# EAGLE design seismometer_energyboard (EAGLE 7.0.0)
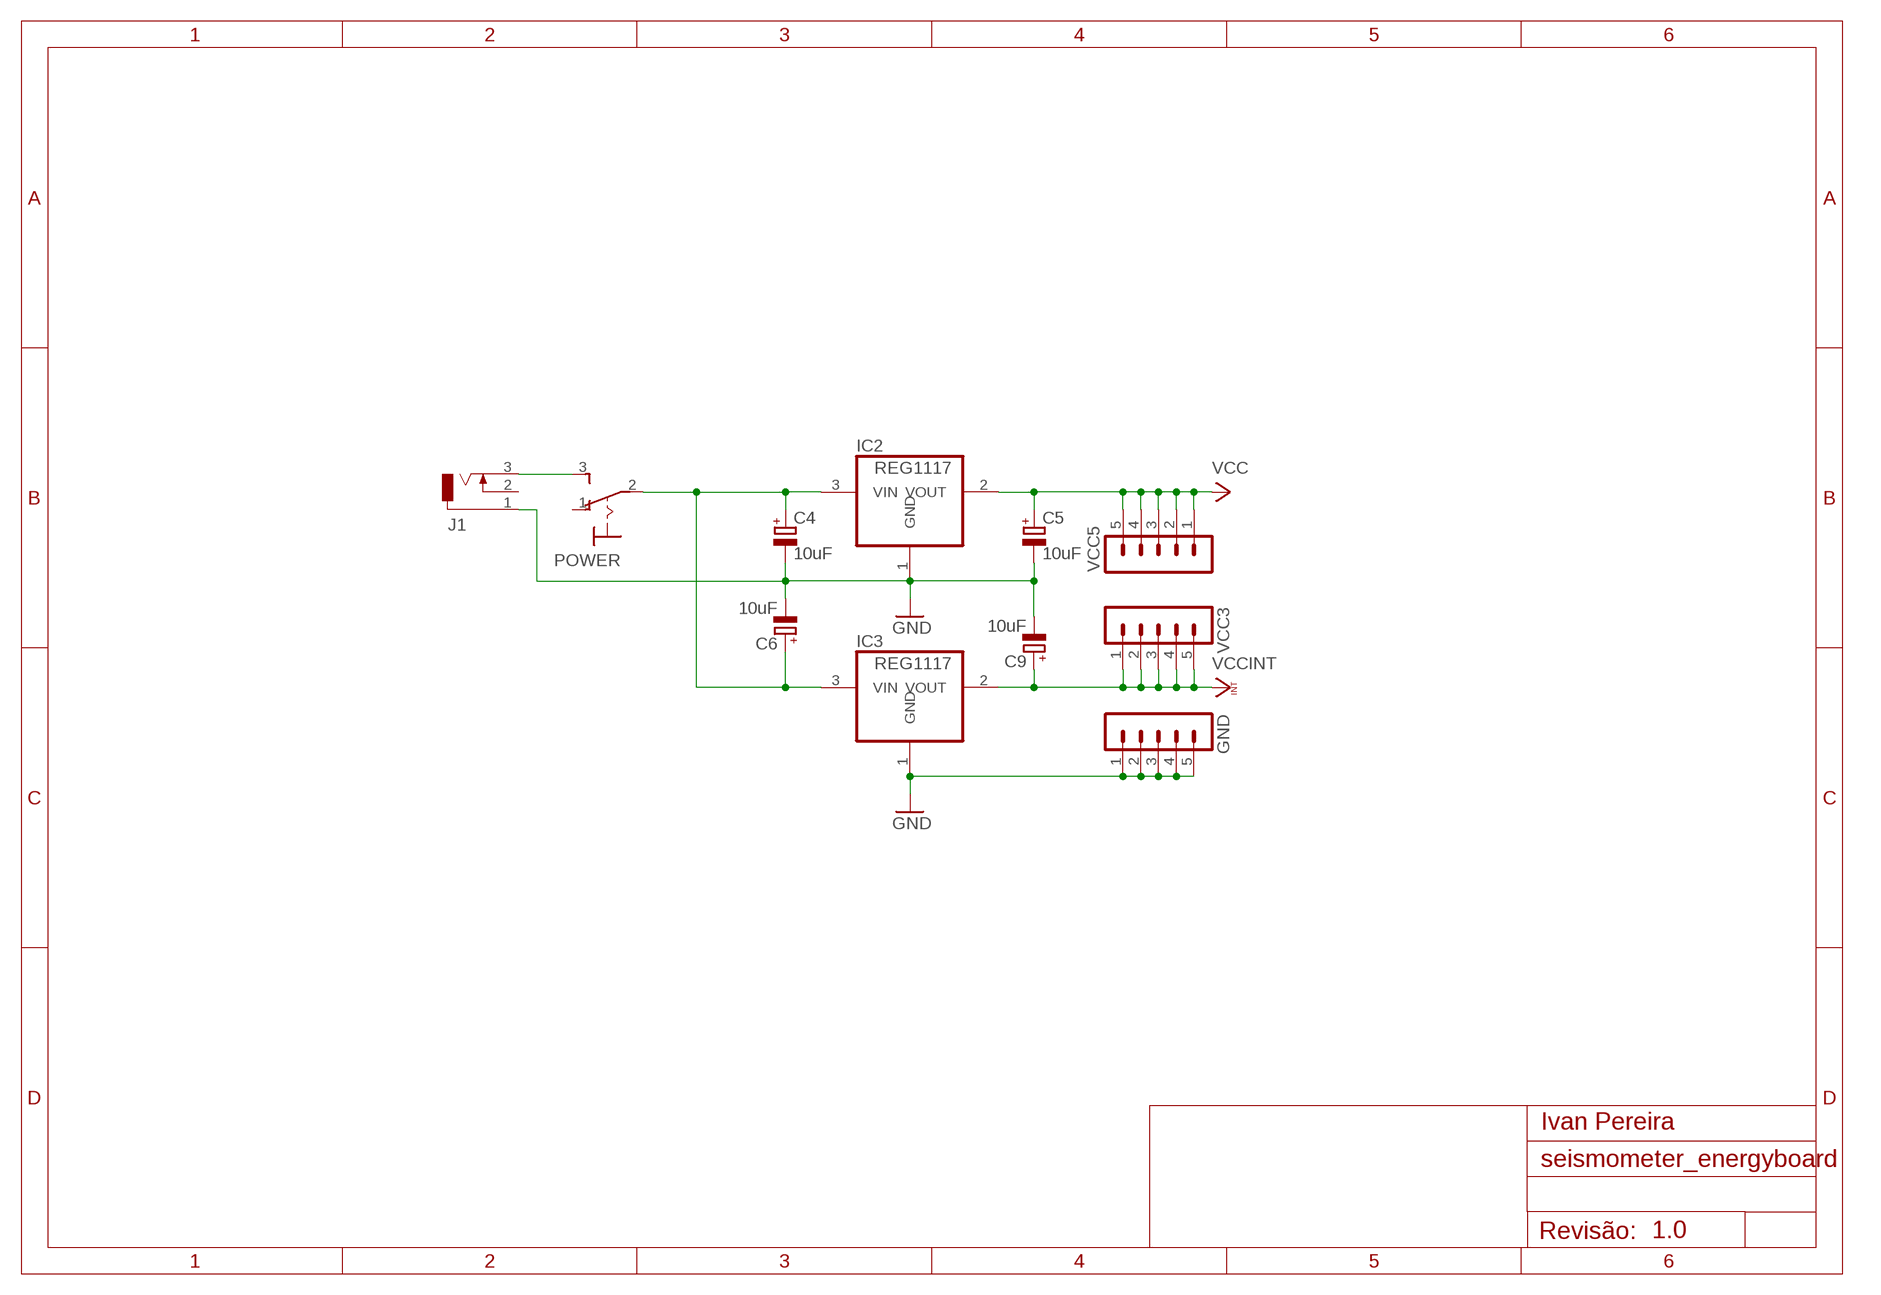
[diagram p0: schematic, sheet 1]
FRAME1 (A4L-LOC): AUTHOR: Ivan Pereira; REV: 1.0

## Parts
C4  10uF  CPOL-EUE2.5-6  [E2,5-6]
C5  10uF  CPOL-EUE2.5-6  [E2,5-6]
C6  10uF  CPOL-EUE2.5-6  [E2,5-6]
C9  10uF  CPOL-EUE2.5-6  [E2,5-6]
GND  MA05-1  [MA05-1]
IC2  REG1117  [SOT223]
IC3  REG1117  [SOT223]
J1  DCJ0303  [DCJ0303]
POWER  320-916  [320-916]
VCC3  MA05-1  [MA05-1]
VCC5  MA05-1  [MA05-1]

## Nets
GND: C4.- C5.- C6.- C9.- GND.1 GND.2 GND.3 GND.4 GND.5 IC2.1(GND) IC3.1(GND) J1.1
N$27: C4.+ C6.+ IC2.3(VIN) IC3.3(VIN) POWER.2(P)
N$29: J1.3 POWER.3(S)
VCC: C5.+ IC2.2(VOUT) VCC5.1 VCC5.2 VCC5.3 VCC5.4 VCC5.5
VCCINT: C9.+ IC3.2(VOUT) VCC3.1 VCC3.2 VCC3.3 VCC3.4 VCC3.5
Unconnected: J1.2 POWER.1(O)

## Library data of the parts
C4-C6 C9 = rcl:CPOL-EU: POLARIZED CAPACITOR, European symbol
GND VCC3 VCC5 = con-lstb:MA05-1: PIN HEADER; OC_FARNELL: unknown; OC_NEWARK: unknown
IC2 IC3 = burr-brown:REG1117: 800mA and 1A Low Dropout (LDO) Positive Regulator 1.8V, 2.5V, 2.85V, 3.3V, 5V, and Adj; MPN: REG1117; OC_FARNELL: 1097566; OC_NEWARK: 14P6981
J1 = con-jack:DCJ0303: DC POWER JACK Source: DCJ0303.pdf; OC_FARNELL: unknown; OC_NEWARK: unknown
POWER = switch:320-916: TOGGLE SWITCH distributor RS Components

## Board
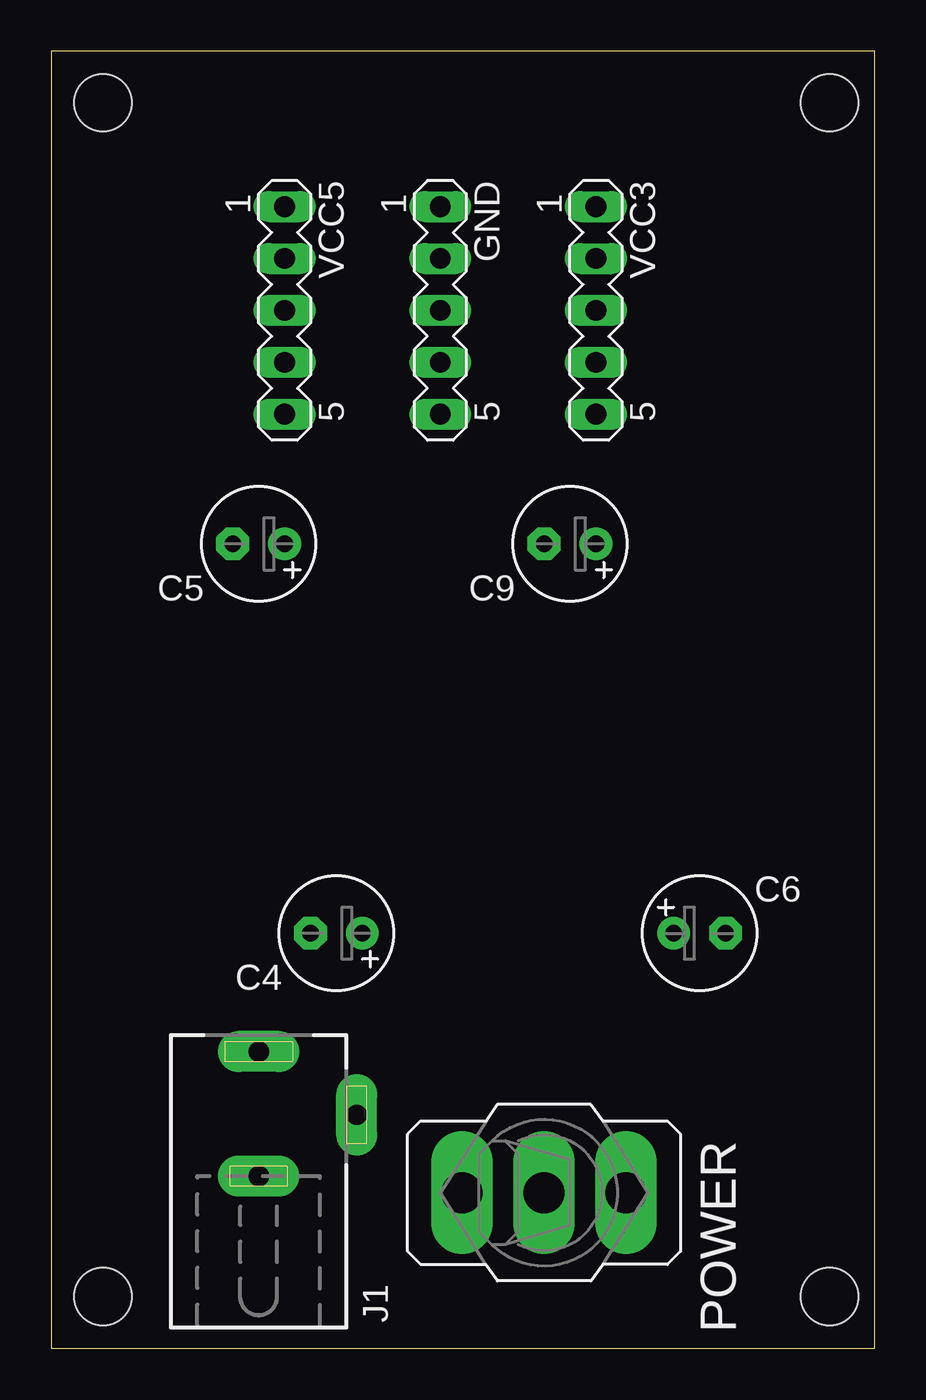
[diagram p1: board, top side]
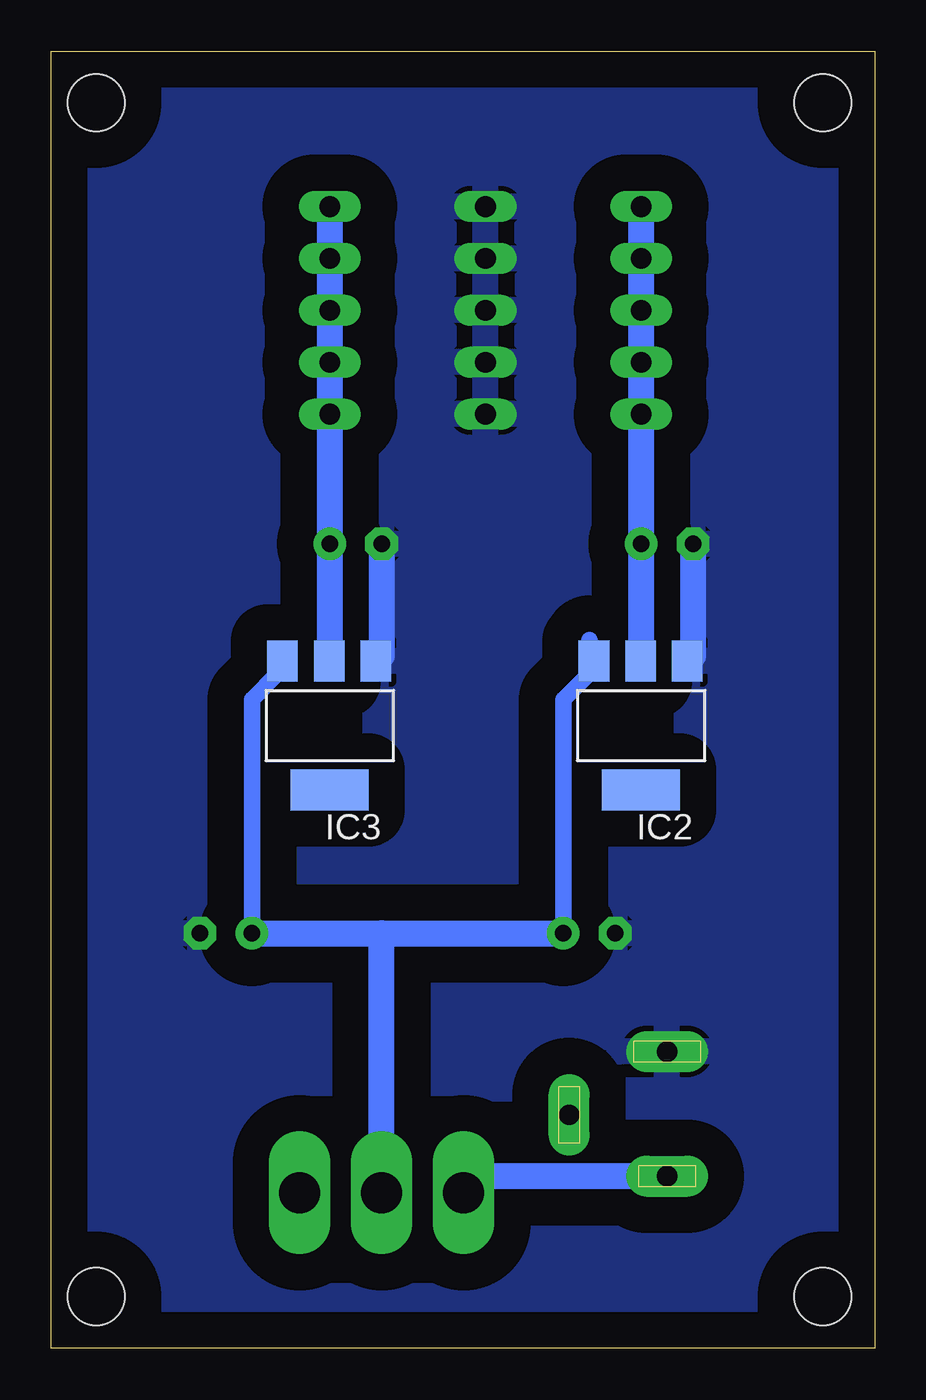
[diagram p2: board, bottom side, seen from below]

Size 40.31 x 63.49 mm. Coordinates in mm from the lower left corner, seen from the top.
Outline: 0,0 40.31,0 40.31,63.49 0,63.49 0,0
Copper layers (1*16): Top 0.035mm / dielectric 1.5mm / Bottom 0.035mm
Design rules "default": minimum track width 10mil, minimum drill 24mil, track to track 8mil, track to pad 8mil, pad to pad 8mil, via to via 8mil, smd to smd 8mil, copper to edge 40mil, drill to drill 8mil, minimum pad ring 10mil, minimum via ring 8mil, stop-mask expansion 4mil, vias tented up to drill 0mil, thermal gap 10mil
Holes 2.8 mm at 2.54,2.54 2.54,60.96 38.1,60.96 38.1,2.54

### Footprints (pad centres in the part's own frame; a part is rotated, then mirrored left to right if it is on the bottom)
E2,5-6 = drill 0.813 pad 1.6: + -1.27,0 | drill 0.813 pad 1.6 octagon: - 1.27,0
MA05-1 = drill 1.016 long: 1 -5.08,0; 2 -2.54,0; 3 0,0; 4 2.54,0; 5 5.08,0
SOT223 = smd 1.499 x 2.007: 1 -2.261,-3.15; 2 0.025,-3.15; 3 2.311,-3.15 | smd 3.81 x 2.007: 4 0,3.15
DCJ0303 = drill 1 pad 2 long: 1 0,3.1; 2 4.8,0; 3 0,-3
320-916 = drill 2.007 long: 1 0,4.013; 2 0,0; 3 0,-4.013

### Placement (x,y rotation side)
C4  13.97,20.32 180 top
C5  10.16,39.37 180 top
C6  31.75,20.32 0 top
C9  25.4,39.37 180 top
GND  19.05,50.8 270 top
IC2  11.43,30.48 180 bottom
IC3  26.67,30.48 180 bottom
J1  10.16,11.43 0 top
POWER  24.13,7.62 270 top
VCC3  26.67,50.8 270 top
VCC5  11.43,50.8 270 top

### Tracks (layer width: path | path; a pad name or v marks a point on that pad's centre or on a via)
GND
  Bottom 1.27: C5.- 8.89,33.91 IC2.1 | C9.- 24.13,33.91 IC3.1
  pour Bottom (isolate 1.778): 1.27,1.27 1.27,62.23 39.37,62.23 39.37,1.27
N$27
  Bottom 0.813: C4.+ 15.24,31.75 13.97,33.02 13.97,34.67 IC2.3 | C6.+ 30.48,31.75 29.21,33.02 29.21,33.4 IC3.3
  Bottom 1.27: C6.+ 24.13,20.32 | 24.13,20.32 C4.+ | POWER.2 24.13,20.32
N$29
  Bottom 1.27: J1.3 19.31,8.43 POWER.3
VCC
  Bottom 1.27: VCC5.1 VCC5.2 VCC5.3 VCC5.4 VCC5.5 C5.+ 11.43,33.66 IC2.2
VCCINT
  Bottom 1.27: IC3.2 26.67,33.66 C9.+ VCC3.5 VCC3.4 VCC3.3 VCC3.2 VCC3.1